# EAGLE design myBoardFPGA (EAGLE 9.6.2)
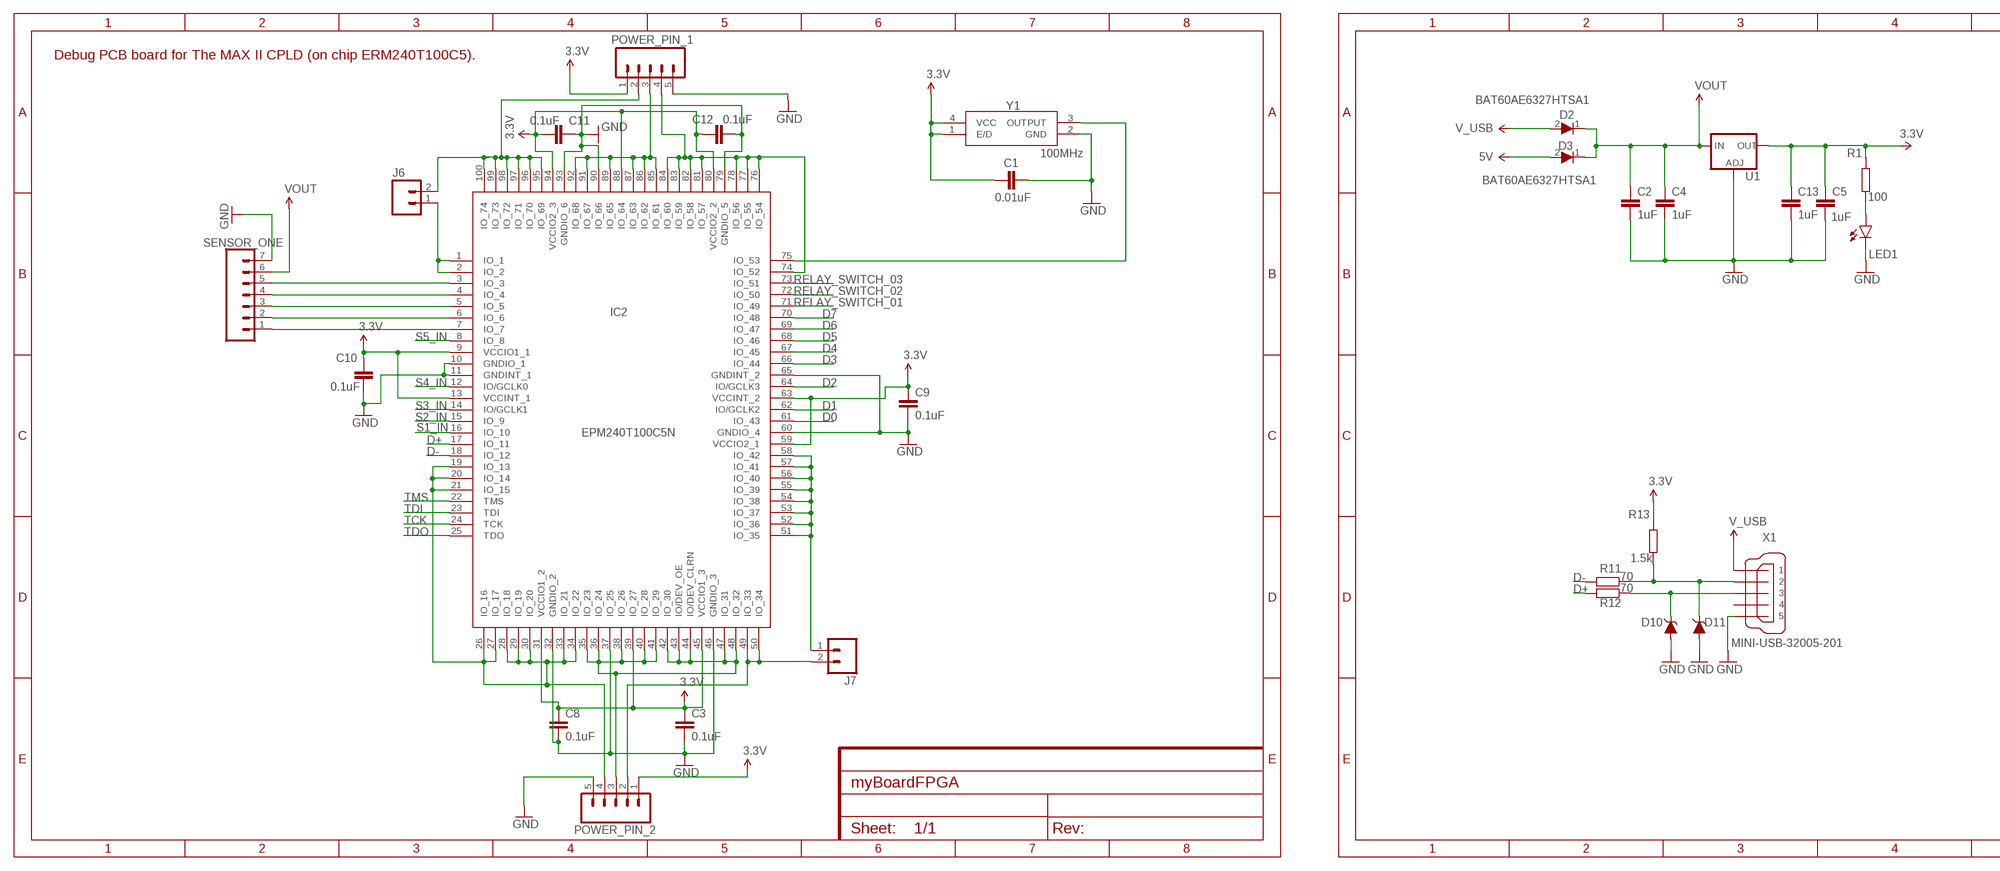
[diagram p0: schematic, sheet 1, part 1 of 2]
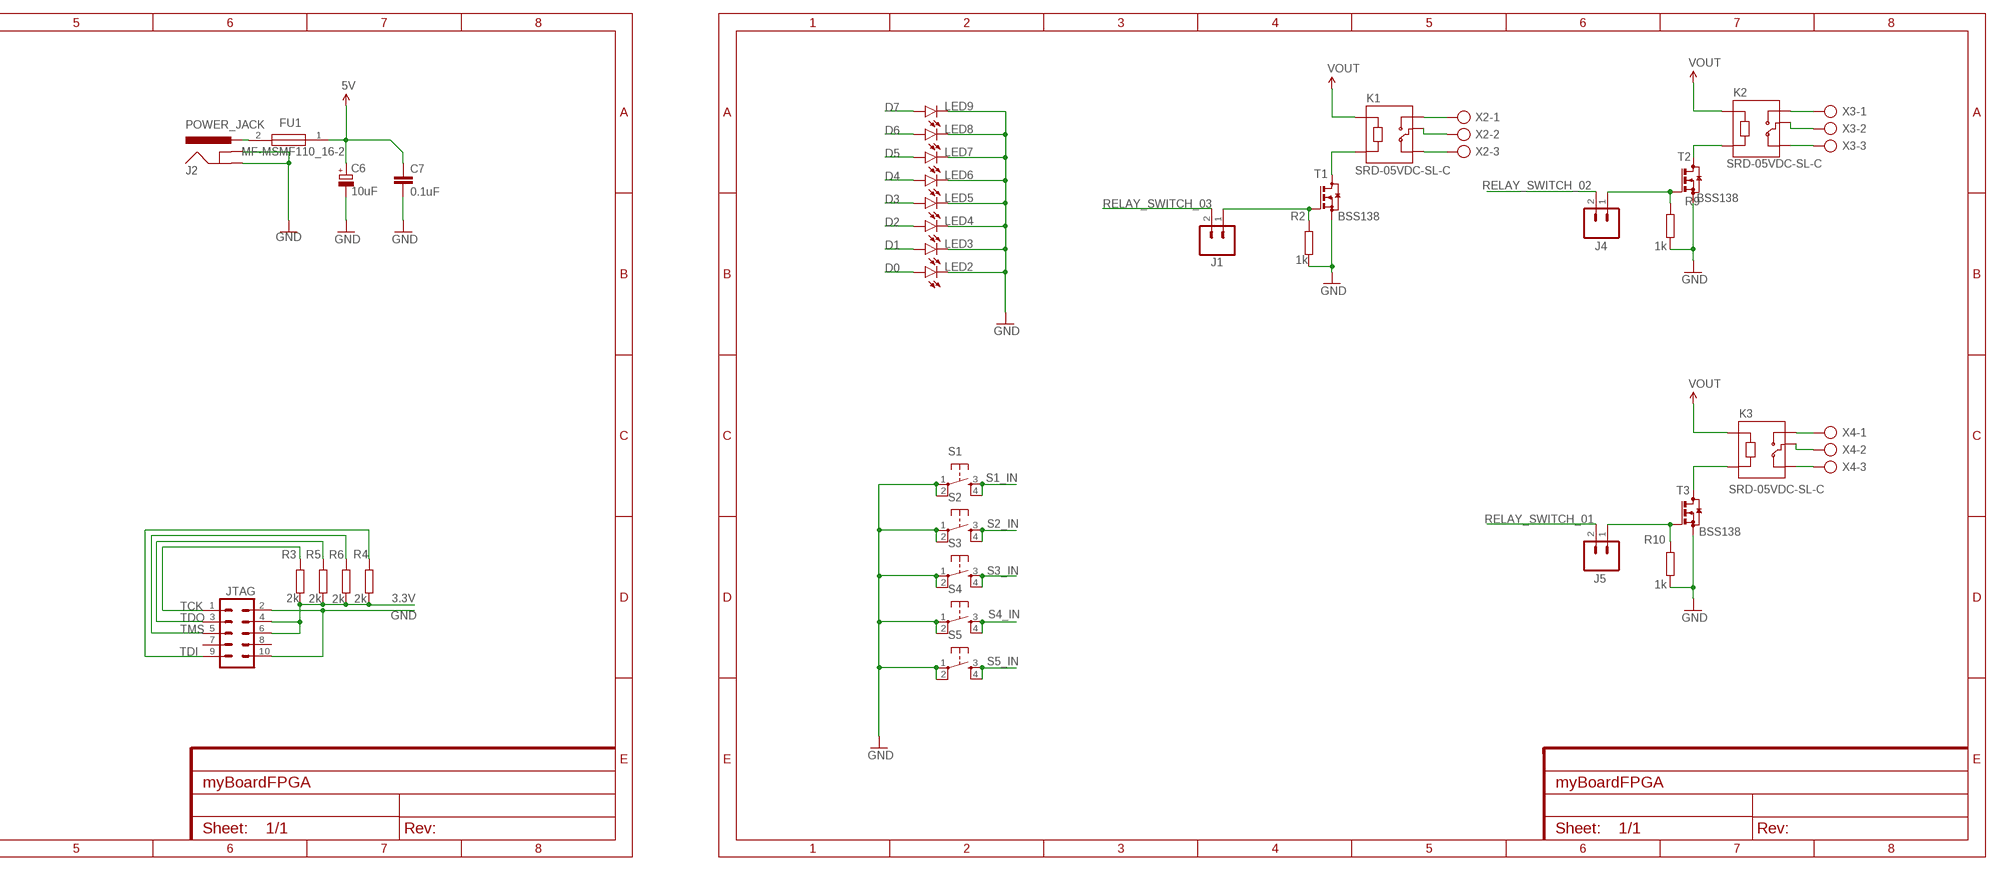
[diagram p1: schematic, sheet 1, part 2 of 2]

## Parts
C1  0.01uF  C-EUC1206  [C1206]
C2  1uF  C-EUC1206  [C1206]
C3  0.1uF  C-EUC1206  [C1206]
C4  1uF  C-EUC1206  [C1206]
C5  1uF  C-EUC1206  [C1206]
C6  10uF  CPOL-EUE2-5  [E2-5]
C7  0.1uF  C-EUC1206  [C1206]
C8  0.1uF  C-EUC1206  [C1206]
C9  0.1uF  C-EUC1206  [C1206]
C10  0.1uF  C-EUC1206  [C1206]
C11  0.1uF  C-EUC1206  [C1206]
C12  0.1uF  C-EUC1206  [C1206]
C13  1uF  C-EUC1206  [C1206]
D2  BAT60AE6327HTSA1  [SOD2513X110N]
D3  BAT60AE6327HTSA1  [SOD2513X110N]
D10  3.3V  DIODEZ  [BZV55C3V9TP]
D11  3.6  DIODEZ  [BZV55C3V9TP]
FU1  MF-MSMF110_16-2  [FUSC4632X85N]
IC2  EPM240T100C5N  [QFP50P1600X1600X120-100N]
J1  M02LOCK  [1X02_LOCK]
J2  POWER_JACK  [POWER_JACK_PTH]
J4  M02LOCK  [1X02_LOCK]
J5  M02LOCK  [1X02_LOCK]
J6  M02LOCK  [1X02_LOCK]
J7  M02LOCK  [1X02_LOCK]
JTAG  M05X2NO_SILK  [2X5_NOSILK]
K1  SRD-05VDC-SL-C  [RELAY_SRD-05VDC-SL-C]
K2  SRD-05VDC-SL-C  [RELAY_SRD-05VDC-SL-C]
K3  SRD-05VDC-SL-C  [RELAY_SRD-05VDC-SL-C]
LED1  LEDSML0805  [SML0805]
LED2  LEDSMT1206  [1206]
LED3  LEDSMT1206  [1206]
LED4  LEDSMT1206  [1206]
LED5  LEDSMT1206  [1206]
LED6  LEDSMT1206  [1206]
LED7  LEDSMT1206  [1206]
LED8  LEDSMT1206  [1206]
LED9  LEDSMT1206  [1206]
POWER_PIN_1  M05LOCK  [1X05_LOCK]
POWER_PIN_2  M05LOCK  [1X05_LOCK]
R1  100  R-EU_R1206  [R1206]
R2  1k  R-EU_R1206  [R1206]
R3  2k  R-EU_R1206  [R1206]
R4  2k  R-EU_R1206  [R1206]
R5  2k  R-EU_R1206  [R1206]
R6  2k  R-EU_R1206  [R1206]
R9  1k  R-EU_R1206  [R1206]
R10  1k  R-EU_R1206  [R1206]
R11  70  R-EU_R1206  [R1206]
R12  70  R-EU_R1206  [R1206]
R13  1.5k  R-EU_R1206  [R1206]
S1  TAC_SWITCHPTH  [TACTILE-PTH]
S2  TAC_SWITCHPTH  [TACTILE-PTH]
S3  TAC_SWITCHPTH  [TACTILE-PTH]
S4  TAC_SWITCHPTH  [TACTILE-PTH]
S5  TAC_SWITCHPTH  [TACTILE-PTH]
SENSOR_ONE  CONN_07  [1X07]
T1  BSS123  [SOT23]
T2  BSS123  [SOT23]
T3  BSS123  [SOT23]
U1  V_REG_LM1117SOT223  [SOT223]
X1  MINI-USB-32005-201  [32005-201]
X2  AK300/3  [AK300/3]
X3  AK300/3  [AK300/3]
X4  AK300/3  [AK300/3]
Y1  100MHz  CO4605-100.000-T-TR  [CO4605100000TTR]

## Nets
3.3V: C1.1 C3.1 C5.1 C8.1 C9.1 C10.1 C11.2 C12.1 C13.1 IC2.9(VCCIO1_1) IC2.13(VCCINT_1) IC2.31(VCCIO1_2) IC2.39(IO_27) IC2.45(VCCIO1_3) IC2.59(VCCIO2_1) IC2.63(VCCINT_2) IC2.80(VCCIO2_2) IC2.88(IO_64) IC2.94(VCCIO2_3) JTAG.4 JTAG.6 POWER_PIN_1.1 POWER_PIN_2.1 R1.2 R3.1 R4.1 R5.1 R6.1 R13.2 U1.2(OUT) U1.4(OUT) Y1.1(E/D) Y1.4(VCC)
5V: C6.+ C7.1 D3.2(A) FU1.1
D0: IC2.61(IO_43) LED2.A
D1: IC2.62(IO/GCLK2) LED3.A
D2: IC2.64(IO/GCLK3) LED4.A
D3: IC2.66(IO_44) LED5.A
D4: IC2.67(IO_45) LED6.A
D5: IC2.68(IO_46) LED7.A
D6: IC2.69(IO_47) LED8.A
D7: IC2.70(IO_48) LED9.A
D+: IC2.17(IO_11) R12.2
D-: IC2.18(IO_12) R11.2
GND: C1.2 C2.2 C3.2 C4.2 C5.2 C6.- C7.2 C8.2 C9.2 C10.2 C11.1 C12.2 C13.2 D10.1(A) D11.1(A) IC2.10(GNDIO_1) IC2.11(GNDINT_1) IC2.32(GNDIO_2) IC2.37(IO_25) IC2.46(GNDIO_3) IC2.60(GNDIO_4) IC2.65(GNDINT_2) IC2.79(GNDIO_5) IC2.90(IO_66) IC2.93(GNDIO_6) J2.GND J2.GNDBREAK JTAG.2 JTAG.10 LED1.C LED2.C LED3.C LED4.C LED5.C LED6.C LED7.C LED8.C LED9.C POWER_PIN_1.5 POWER_PIN_2.5 R2.1 R9.1 R10.1 S1.1 S1.2 S2.1 S2.2 S3.1 S3.2 S4.1 S4.2 S5.1 S5.2 SENSOR_ONE.7 T1.2(S) T2.2(S) T3.2(S) U1.1(ADJ) X1.5 Y1.2(GND)
N$1: K1.A2 T1.3(D)
N$2: LED1.A R1.1
N$3: K1.NO X2.1
N$4: K1.NC X2.3
N$5: K2.A2 T2.3(D)
N$6: J1.1 R2.2 T1.1(G)
N$7: K3.A2 T3.3(D)
N$8: J4.1 R9.2 T2.1(G)
N$9: J5.1 R10.2 T3.1(G)
N$10: K1.COM X2.2
N$11: K2.NO X3.1
N$12: K2.COM X3.2
N$13: K2.NC X3.3
N$14: K3.COM X4.2
N$15: K3.NO X4.1
N$16: K3.NC X4.3
N$18: IC2.35(IO_23) IC2.36(IO_24) IC2.38(IO_26) IC2.40(IO_28) IC2.41(IO_29) IC2.42(IO_30) IC2.43(IO/DEV_OE) IC2.44(IO/DEV_CLRN) IC2.47(IO_31) IC2.48(IO_32) POWER_PIN_2.3
N$20: IC2.19(IO_13) IC2.20(IO_14) IC2.21(IO_15) IC2.26(IO_16) IC2.27(IO_17) IC2.28(IO_18) IC2.29(IO_19) IC2.30(IO_20) IC2.33(IO_21) IC2.34(IO_22) POWER_PIN_2.4
N$21: D11.2(C) R11.1 R13.1 X1.2
N$22: D10.2(C) R12.1 X1.3
N$23: IC2.7(IO_7) SENSOR_ONE.1
N$24: IC2.49(IO_33) IC2.50(IO_34) J7.2 POWER_PIN_2.2
N$25: IC2.6(IO_6) SENSOR_ONE.2
N$26: IC2.5(IO_5) SENSOR_ONE.3
N$27: IC2.51(IO_35) IC2.52(IO_36) IC2.53(IO_37) IC2.54(IO_38) IC2.55(IO_39) IC2.56(IO_40) IC2.57(IO_41) IC2.58(IO_42) J7.1
N$28: IC2.75(IO_53) Y1.3(OUTPUT)
N$29: IC2.4(IO_4) SENSOR_ONE.4
N$30: IC2.3(IO_3) SENSOR_ONE.5
N$31: IC2.1(IO_1) IC2.2(IO_2) J6.1
N$32: IC2.95(IO_69) IC2.96(IO_70) IC2.97(IO_71) IC2.98(IO_72) IC2.99(IO_73) IC2.100(IO_74) J6.2 POWER_PIN_1.2
N$33: FU1.2 J2.PWR
N$35: IC2.74(IO_52) IC2.76(IO_54) IC2.77(IO_55) IC2.78(IO_56) IC2.81(IO_57) IC2.82(IO_58) IC2.83(IO_59) IC2.84(IO_60) POWER_PIN_1.4
N$36: IC2.85(IO_61) IC2.86(IO_62) IC2.87(IO_63) IC2.89(IO_65) IC2.91(IO_67) IC2.92(IO_68) POWER_PIN_1.3
RELAY_SWITCH_01: IC2.71(IO_49) J5.2
RELAY_SWITCH_02: IC2.72(IO_50) J4.2
RELAY_SWITCH_03: IC2.73(IO_51) J1.2
S1_IN: IC2.16(IO_10) S1.3 S1.4
S2_IN: IC2.15(IO_9) S2.3 S2.4
S3_IN: IC2.14(IO/GCLK1) S3.3 S3.4
S4_IN: IC2.12(IO/GCLK0) S4.3 S4.4
S5_IN: IC2.8(IO_8) S5.3 S5.4
TCK: IC2.24(TCK) JTAG.1 R3.2
TDI: IC2.23(TDI) JTAG.9 R4.2
TDO: IC2.25(TDO) JTAG.3 R5.2
TMS: IC2.22(TMS) JTAG.5 R6.2
V_USB: D2.2(A) X1.1
VOUT: C2.1 C4.1 D2.1(K) D3.1(K) K1.A1 K2.A1 K3.A1 SENSOR_ONE.6 U1.3(IN)
Unconnected: JTAG.7 JTAG.8 X1.4

## Notes on the sheet
- Debug PCB board for The MAX II CPLD (on chip ERM240T100C5).

## Library data of the parts
C1-C5 C7-C13 = rcl:C-EU: CAPACITOR, European symbol; SPICEPREFIX: C
C6 = rcl:CPOL-EU: POLARIZED CAPACITOR, European symbol; SPICEPREFIX: C
D2 D3 = SamacSys_Parts:BAT60AE6327HTSA1: INFINEON - BAT60AE6327HTSA1 - RECTIFIER, SCHOTTKY, 3A, 10V, SOD-323 Source: Datasheet <https://www.infineon.com/dgdl/Infineon-BAT60ASERIES-DS-v01_01-en.pdf?fileId=db3a304313d846880113def70c9304a9>; ARROW_PART_NUMBER: BAT60AE6327HTSA1; ARROW_PRICE-STOCK: https://www.arrow.com/en/products/bat60ae6327htsa1/infineon-technologies-ag; DESCRIPTION: INFINEON - BAT60AE6327HTSA1 - RECTIFIER, SCHOTTKY, 3A, 10V, SOD-323; HEIGHT: 1.1mm; MANUFACTURER_NAME: Infineon; MANUFACTURER_PART_NUMBER: BAT60AE6327HTSA1; MOUSER_PART_NUMBER: 726-BAT60AE6327HTSA1; MOUSER_PRICE-STOCK: https://www.mouser.co.uk/ProductDetail/Infineon-Technologies/BAT60AE6327HTSA1?qs=OwbwYO03UsIW3Y2lCXbs8Q%3D%3D
D10 = myZd:DIODEZ
D11 = myZd:DIODEZ; SDA: 3.6V
FU1 = SamacSys_Parts:MF-MSMF110_16-2: Fuse, PTC, Resettable, SMD,1812,1.1A,16V Bourns 1.1A Surface Mount Resettable Fuse, 16 V Source: Datasheet <https://componentsearchengine.com/Datasheets/2/MF-MSMF110_16-2.pdf>; ARROW_PART_NUMBER: MF-MSMF110/16-2; ARROW_PRICE-STOCK: https://www.arrow.com/en/products/mf-msmf11016-2/bourns; DESCRIPTION: Fuse, PTC, Resettable, SMD,1812,1.1A,16V Bourns 1.1A Surface Mount Resettable Fuse, 16 V; HEIGHT: 0.85mm; MANUFACTURER_NAME: Bourns; MANUFACTURER_PART_NUMBER: MF-MSMF110/16-2; MOUSER_PART_NUMBER: 652-MF-MSMF110/16-2; MOUSER_PRICE-STOCK: https://www.mouser.co.uk/ProductDetail/Bourns/MF-MSMF110-16-2?qs=wksszfECgvir54ST3ixUHA%3D%3D
IC2 = SamacSys_Parts:EPM240T100C5N: CPLD Max II EPM240T100C5N, TQFP100 EPM240T100C5N, CPLD MAX II Flash 192 Cells, 80 I/O, 24 Labs, ISP, 2.375 3.6 V 100-Pin TQFP Source: Datasheet <http://docs-emea.rs-online.com/webdocs/13d1/0900766b813d195a.pdf>; ARROW_PART_NUMBER: EPM240T100C5N; ARROW_PRICE-STOCK: https://www.arrow.com/en/products/epm240t100c5n/intel; DESCRIPTION: CPLD Max II EPM240T100C5N, TQFP100 EPM240T100C5N, CPLD MAX II Flash 192 Cells, 80 I/O, 24 Labs, ISP, 2.375 3.6 V 100-Pin TQFP; HEIGHT: 1.2mm; MANUFACTURER_NAME: Intel; MANUFACTURER_PART_NUMBER: EPM240T100C5N; MOUSER_PART_NUMBER: 989-EPM240T100C5N; MOUSER_PRICE-STOCK: https://www.mouser.co.uk/ProductDetail/Intel-Altera/EPM240T100C5N?qs=jblrfmjbeiHmgaW5DQXOiw%3D%3D
J1 J4-J7 = SparkFun-Connectors:M02: Standard 2-pin 0.1" header. Use with - straight break away headers ( PRT-00116) - right angle break away headers (PRT-00553) - swiss pins (PRT-00743) - machine pins (PRT-00117) - female headers (PRT-00115) Molex polarized connector foot print use with: PRT-08233 with associated crimp pins and housings. 2.54_SCREWTERM for use with PRT-10571. 3.5mm Screw Terminal footprints for PRT-08084 5mm Screw Terminal footprints for use with PRT-08432
J2 = SparkFun-Connectors:POWER_JACK: Power Jack Connector This is the standard 5.5mm barrel jack for power. The PTH is the most common, proven, reliable, footprint. The Slot footprint only works if the mill layer is transmitted to the PCB fab house so be warned. Here are the connectors we sell at SparkFun: DC Barrel Power Jack/Connector <https://www.sparkfun.com/products/119> (PRT-00119) DC Barrel Power Jack/Connector (SMD) <https://www.sparkfun.com/products/12748> (PRT-12748) DC Barrel Jack Adapter - Breadboard Compatible <https://www.sparkfun.com/products/10811> (PRT-10811) It is used on this SparkFun product (and many, many others): SparkFun RedBoard - Programmed with Arduino <https://www.sparkfun.com/products/12757> (DEV-12757) Also, if you need a mating power supply or connector, please check these out: Wall Adapter Power Supply - 9VDC 650mA <https://www.sparkfun.com/products/298> (TOL-00298) DC Barrel Jack Adapter - Male <https://www.sparkfun.com/products/10287> (PRT-10287); PROD_ID: CONN-08197
JTAG = SparkFun-Connectors:M05X2: Header 5x2 Standard 10-pin dual row 0.1" header. Commonly used with AVR-ISP. Use with Spark Fun Electronics SKU: PRT-00778
K1-K3 = SRD-05VDC-SL-C:SRD-05VDC-SL-C: 5V Trigger Relay Module For Arduino And Raspberry Pi 5V Trigger Relay Module For Arduino And Raspberry Pi; AVAILABILITY: Unavailable; DESCRIPTION: 5V Trigger Relay Module For Arduino And Raspberry Pi 5V Trigger Relay Module For Arduino And Raspberry Pi; MF: Songle Relay; MP: SRD-05VDC-SL-C; PACKAGE: None; PRICE: None
LED1-LED9 = led:LED: LED OSRAM: - CHIPLED LG R971, LG N971, LY N971, LG Q971, LY Q971, LO R971, LY R971 LH N974, LH R974 LS Q976, LO Q976, LY Q976 LO Q996 - Hyper CHIPLED LW Q18S LB Q993, LB Q99A, LB R99A - SideLED LS A670, LO A670, LY A670, LG A670, LP A670 LB A673, LV A673, LT A673, LW A673 LH A674 LY A675 LS A676, LA A676, LO A676, LY A676, LW A676 LS A679, LY A679, LG A679 - Hyper Micro SIDELED® LS Y876, LA Y876, LO Y876, LY Y876 LT Y87S - SmartLED LW L88C, LW L88S LB L89C, LB L89S, LG L890 LS L89K, LO L89K, LY L89K LS L896, LA L896, LO L896, LY L896 - TOPLED LS T670, LO T670, LY T670, LG T670, LP T670 LSG T670, LSP T670, LSY T670, LOP T670, LYG T670 LG T671, LOG T671, LSG T671 LB T673, LV T673, LT T673, LW T673 LH T674 LS T676, LA T676, LO T676, LY T676, LB T676, LH T676, LSB T676, LW T676 LB T67C, LV T67C, LT T67C, LS T67K, LO T67K, LY T67K, LW E67C LS E67B, LA E67B, LO E67B, LY E67B, LB E67C, LV E67C, LT E67C LW T67C LS T679, LY T679, LG T679 LS T770, LO T770, LY T770, LG T770, LP T770 LB T773, LV T773, LT T773, LW T773 LH T774 LS E675, LA E675, LY E675, LS T675 LS T776, LA T776, LO T776, LY T776, LB T776 LHGB T686 LT T68C, LB T68C - Hyper Mini TOPLED® LB M676 - Mini TOPLED Santana® LG M470 LS M47K, LO M47K, LY M47K Source: http://www.osram.convergy.de LUXEON: - LUMILED® LXK2-PW12-R00, LXK2-PW12-S00, LXK2-PW14-U00, LXK2-PW14-V00 LXK2-PM12-R00, LXK2-PM12-S00, LXK2-PM14-U00 LXK2-PE12-Q00, LXK2-PE12-R00, LXK2-PE12-S00, LXK2-PE14-T00, LXK2-PE14-U00 LXK2-PB12-K00, LXK2-PB12-L00, LXK2-PB12-M00, LXK2-PB14-N00, LXK2-PB14-P00, LXK2-PB14-Q00 LXK2-PR12-L00, LXK2-PR12-M00, LXK2-PR14-Q00, LXK2-PR14-R00 LXK2-PD12-Q00, LXK2-PD12-R00, LXK2-PD12-S00 LXK2-PH12-R00, LXK2-PH12-S00 LXK2-PL12-P00, LXK2-PL12-Q00, LXK2-PL12-R00 Source: www.luxeon.com KINGBRIGHT: KA-3528ASYC Source: www.kingbright.com
POWER_PIN_1 POWER_PIN_2 = SparkFun-Connectors:M05: Header 5 Standard 5-pin 0.1" header. Use with straight break away headers (SKU : PRT-00116), right angle break away headers (PRT-00553), swiss pins (PRT-00743), machine pins (PRT-00117), and female headers (PRT-00115). Molex polarized connector foot print use with SKU : PRT-08230 with associated crimp pins and housings.
R1-R6 R9-R13 = rcl:R-EU_: RESISTOR, European symbol; SPICEPREFIX: R
S1-S5 = SparkFun-Retired:TAC_SWITCH: Momentary Switch Button commonly used for reset or general input. Spark Fun Electronics SKU : COM-00097 SMT- SWCH-08247
SENSOR_ONE = SparkFun-Connectors:CONN_07: Multi connection point. Often used as Generic Header-pin footprint for 0.1 inch spaced/style header connections On any of the 0.1 inch spaced packages, you can populate with these: Break Away Headers - Straight <https://www.sparkfun.com/products/116> (PRT-00116) Break Away Male Headers - Right Angle <https://www.sparkfun.com/products/553> (PRT-00553) Female Headers <https://www.sparkfun.com/products/115> (PRT-00115) Break Away Headers - Machine Pin <https://www.sparkfun.com/products/117> (PRT-00117) Break Away Female Headers - Swiss Machine Pin <https://www.sparkfun.com/products/743> (PRT-00743) For SCREWTERMINALS and SPRING TERMINALS visit here: Screw Terimnals on SparkFun.com <https://www.sparkfun.com/search/results?term=Screw+Terminals> (5mm/3.5mm/2.54mm spacing) This device is also useful as a general connection point to wire up your design to another part of your project. Our various solder wires solder well into these plated through hole pads. Hook-Up Wire - Assortment (Stranded, 22 AWG) <https://www.sparkfun.com/products/11375> (PRT-11375) Hook-Up Wire - Assortment (Solid Core, 22 AWG) <https://www.sparkfun.com/products/11367> (PRT-11367) View the entire wire category on our website here <https://www.sparkfun.com/categories/141> Special notes: Molex polarized connector foot print use with SKU : PRT-08231 with associated crimp pins and housings. 1MM SMD Version SKU: PRT-10208 NOTES ON THE VARIANTS LOCK and LOCK_LONGPADS... This footprint was designed to help hold the alignment of a through-hole component (i.e. 6-pin header) while soldering it into place. You may notice that each hole has been shifted either up or down by 0.005 of an inch from it's more standard position (which is a perfectly straight line). This slight alteration caused the pins (the squares in the middle) to touch the edges of the holes. Because they are alternating, it causes a "brace" to hold the component in place. 0.005 has proven to be the perfect amount of "off-center" position when using our standard breakaway headers. Although looks a little odd when you look at the bare footprint, once you have a header in there, the alteration is very hard to notice. Also,if you push a header all the way into place, it is covered up entirely on the bottom side.
T1 T3 = transistor-small-signal:BSS123: N-CHANNEL MOS FET; NEW: BSS138
T2 = transistor-small-signal:BSS123: N-CHANNEL MOS FET; BSS138: BSS138
U1 = SparkFun-IC-Power:V_REG_LM1117: Voltage Regulator LM1117 Standard adjustable voltage regulator but in SMD form. Spark Fun Electronics SKU : COM-00595; PROD_ID: VREG-08170
X1 = con-cypressindustries:MINI-USB-: MINI USB-B Conector Source: www.cypressindustries.com; OC_FARNELL: unknown; OC_NEWARK: unknown
X2-X4 = con-ptr500:AK300/3: CONNECTOR; OC_FARNELL: unknown; OC_NEWARK: unknown
Y1 = SamacSys_Parts:CO4605-100.000-T-TR: Surface Mount Clock Oscilators. Source: Datasheet <http://www.raltron.com//wp-content/uploads/2018/12/clock_co43_46_Series-updated.pdf>; DESCRIPTION: Surface Mount Clock Oscilators.; HEIGHT: 1.8mm; MANUFACTURER_NAME: Raltron Electronics; MANUFACTURER_PART_NUMBER: CO4605-100.000-T-TR; NEW: 100MHz

## Board
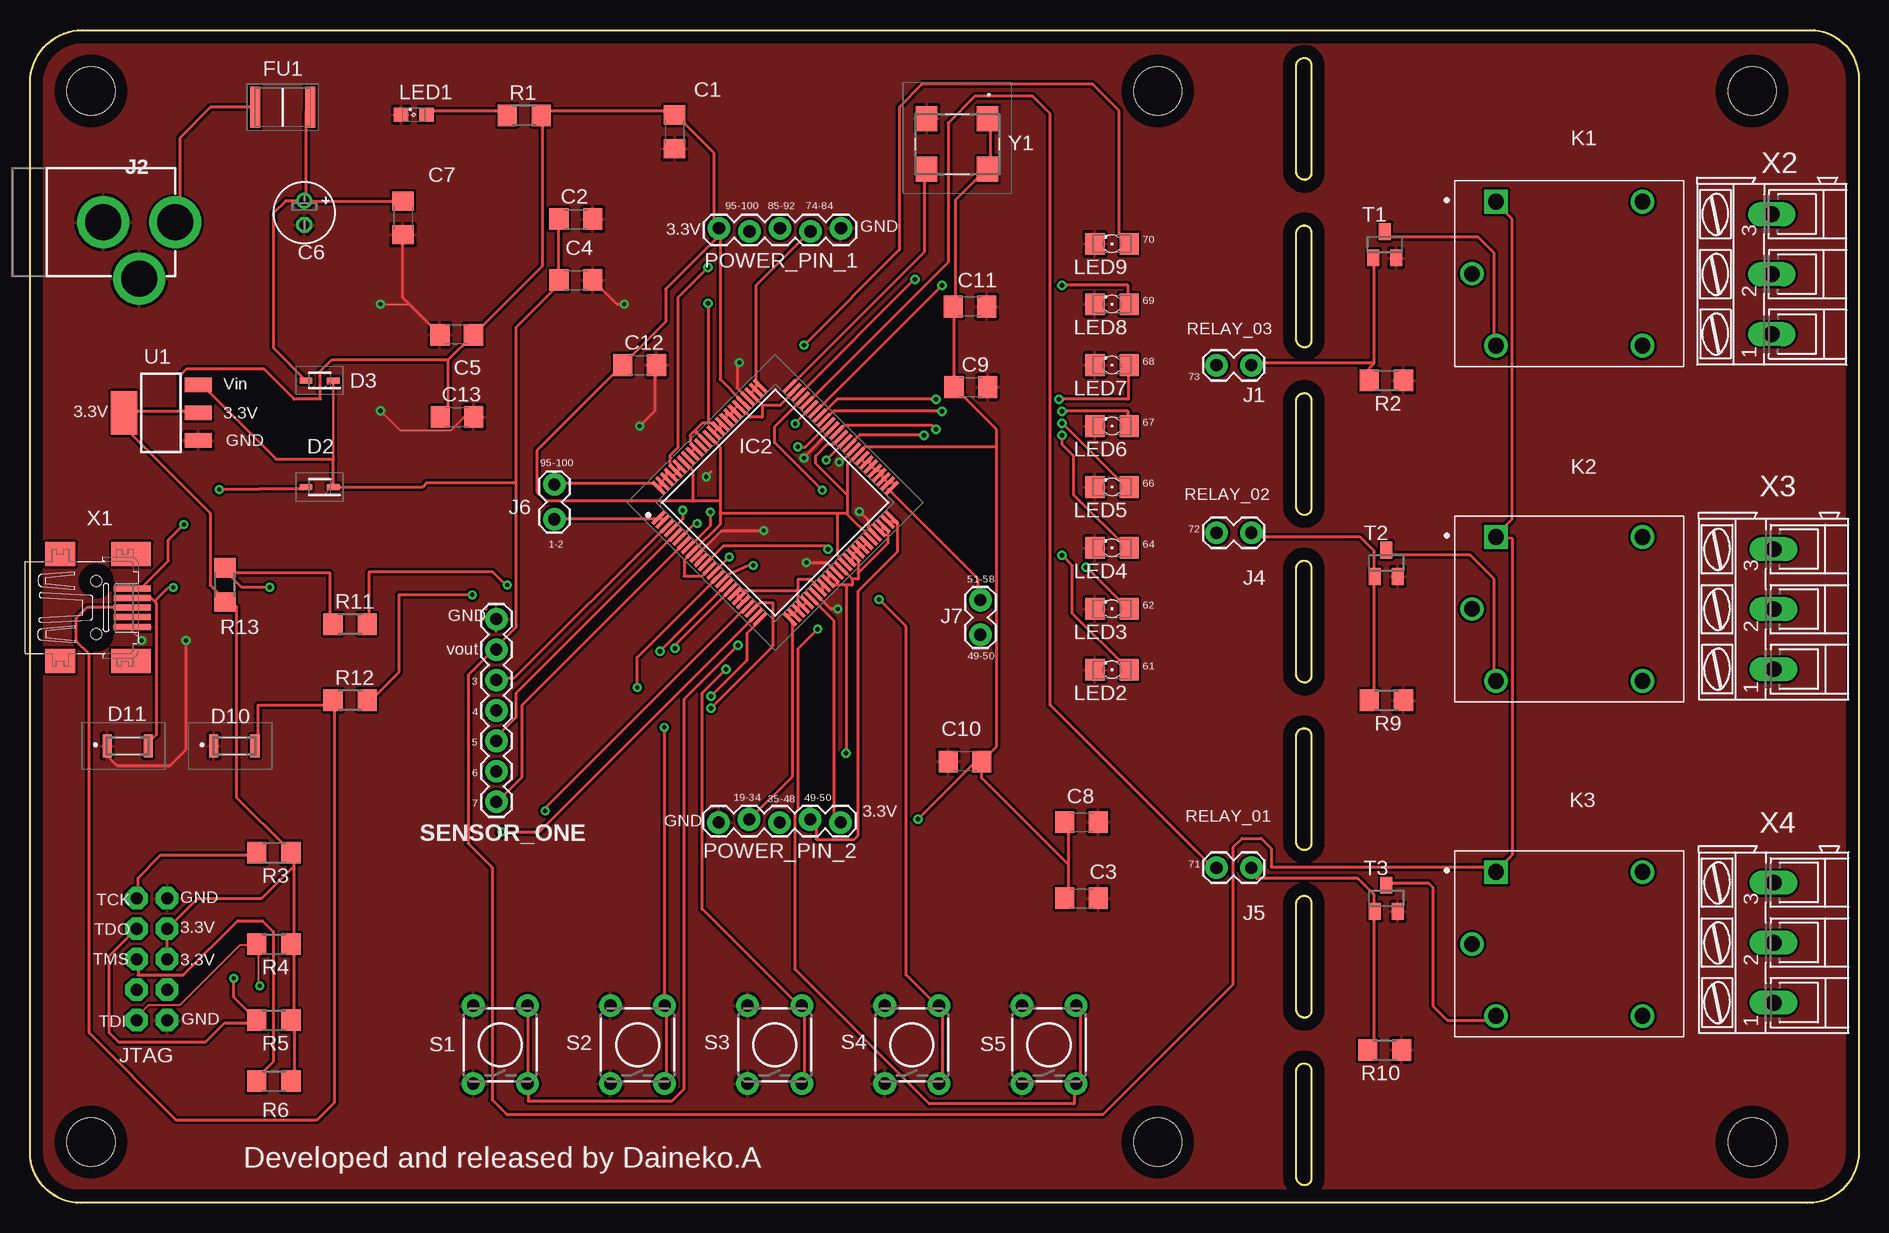
[diagram p2: board, top side]
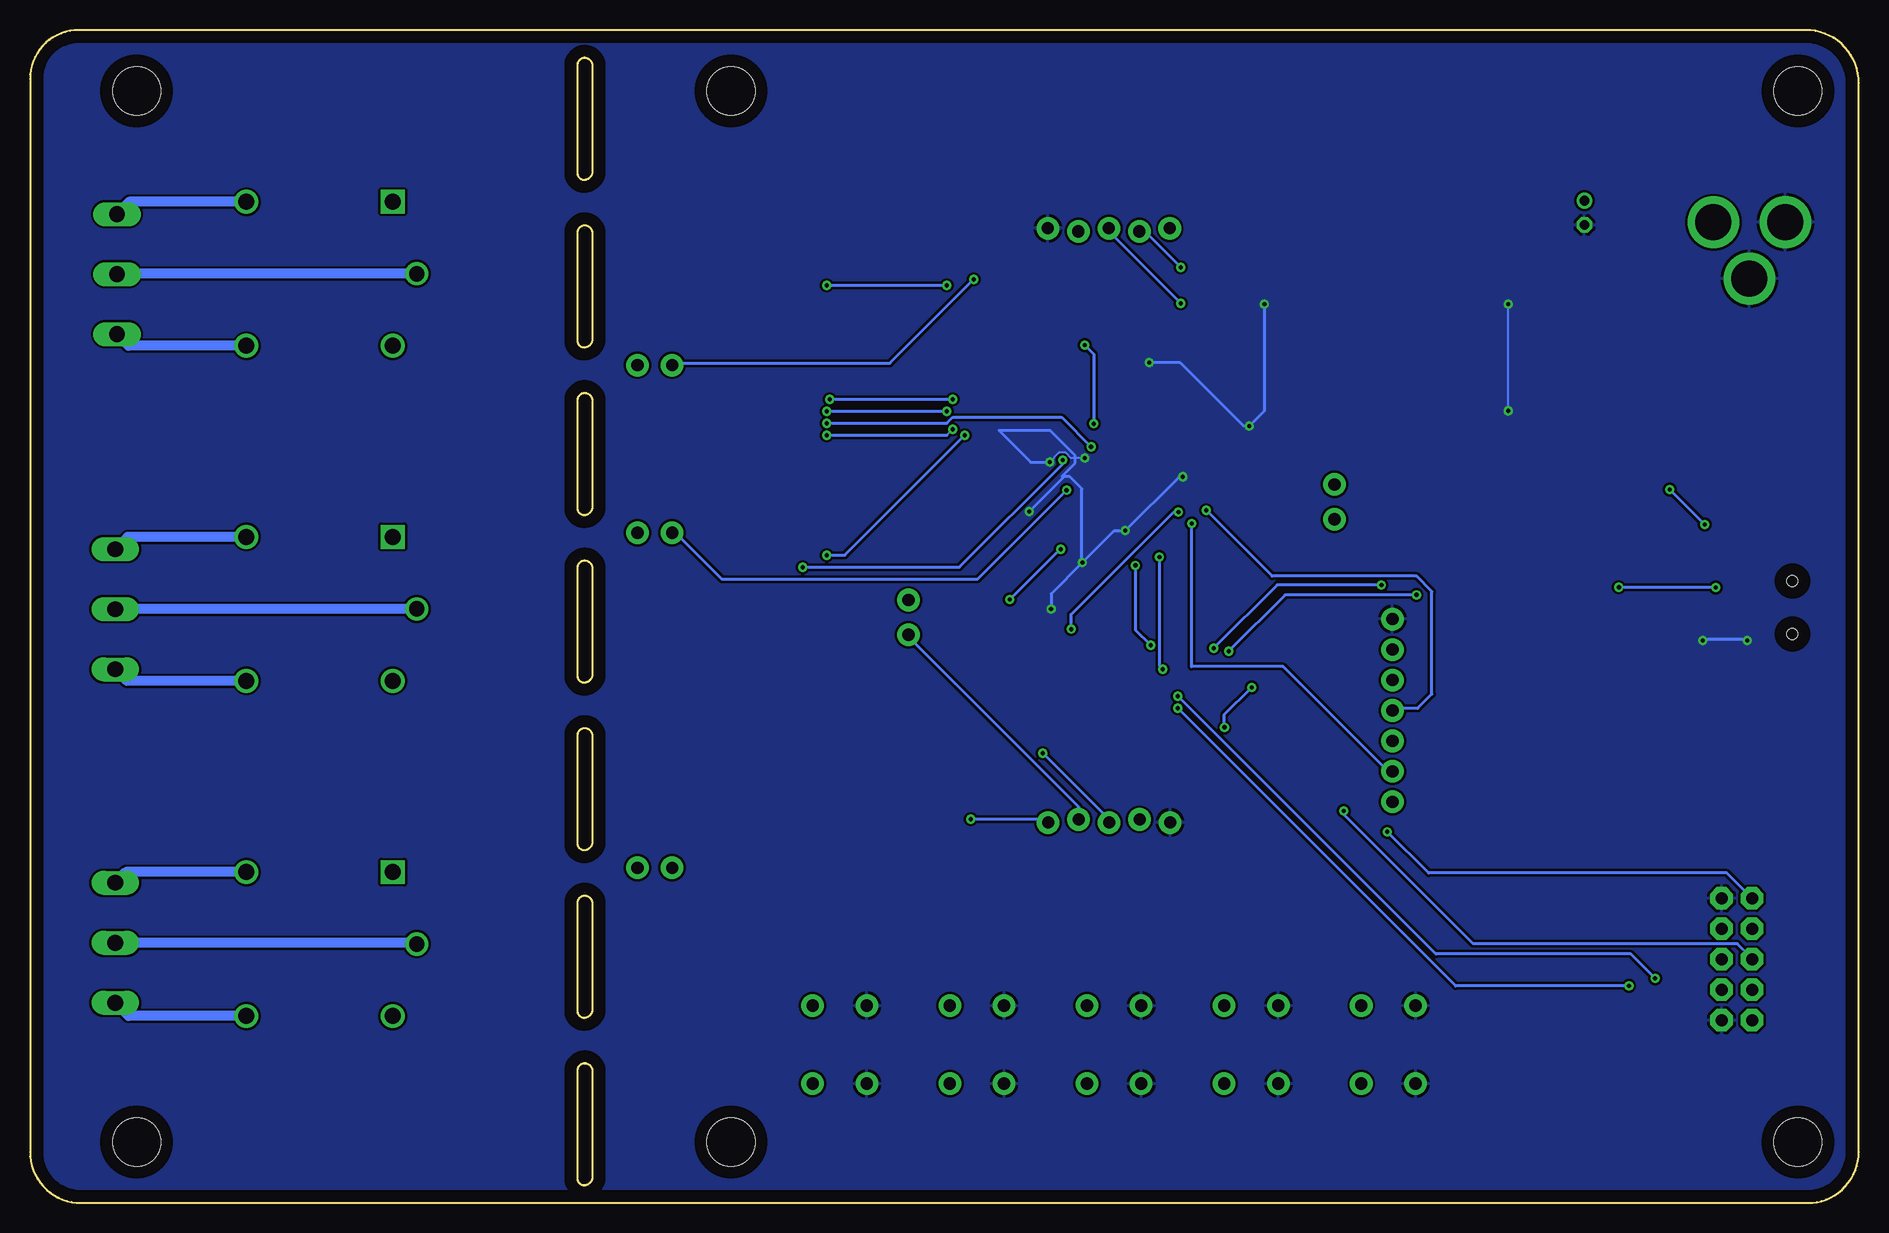
[diagram p3: board, bottom side, seen from below]

Size 152.4 x 97.79 mm. Coordinates in mm from the lower left corner, seen from the top.
Outline: 106.23,1.48 arc-90 105.51,2.2 105.51,10.96 arc-90 106.19,11.64 arc-90 106.78,11.05 106.78,2.03 arc-90 106.23,1.48
Outline: 106.23,15.45 arc-90 105.51,16.17 105.51,24.93 arc-90 106.19,25.61 arc-90 106.78,25.02 106.78,16 arc-90 106.23,15.45
Outline: 106.23,29.42 arc-90 105.51,30.14 105.51,38.9 arc-90 106.19,39.58 arc-90 106.78,38.99 106.78,29.97 arc-90 106.23,29.42
Outline: 106.23,43.39 arc-90 105.51,44.11 105.51,52.87 arc-90 106.19,53.55 arc-90 106.78,52.96 106.78,43.94 arc-90 106.23,43.39
Outline: 106.23,57.36 arc-90 105.51,58.08 105.51,66.84 arc-90 106.19,67.52 arc-90 106.78,66.93 106.78,57.91 arc-90 106.23,57.36
Outline: 106.23,71.33 arc-90 105.51,72.05 105.51,80.81 arc-90 106.19,81.49 arc-90 106.78,80.9 106.78,71.88 arc-90 106.23,71.33
Outline: 106.23,85.3 arc-90 105.51,86.02 105.51,94.78 arc-90 106.19,95.46 arc-90 106.78,94.87 106.78,85.85 arc-90 106.23,85.3
Outline: 152.4,93.71 152.4,4.25 arc-90 148.15,0 4.27,0 arc-90 0,4.27 0,93.38 arc-90 4.42,97.79 148.32,97.79 arc-90 152.4,93.71
Copper layers (1*16): Top 0.035mm / dielectric 1.5mm / Bottom 0.035mm
Design rules "default *": minimum track width 6mil, minimum drill 0.35mm, track to track 8mil, track to pad 6mil, pad to pad 6mil, via to via 6mil, smd to smd 6mil, copper to edge 40mil, drill to drill 6mil, minimum pad ring 10mil, minimum via ring 8mil, stop-mask expansion 4mil, vias tented up to drill 0mil, thermal gap 10mil
Holes 4 mm at 5.08,5.08 143.51,5.08 5.08,92.71 143.51,92.71 93.98,5.08 93.98,92.71

### Footprints (pad centres in the part's own frame; a part is rotated, then mirrored left to right if it is on the bottom)
C1206 = smd 1.6 x 1.8: 1 -1.4,0; 2 1.4,0
E2-5 = drill 0.813 pad 1.27: + -1.016,0 | drill 0.813 pad 1.27 octagon: - 1.016,0
SOD2513X110N = smd 1.05 x 0.5: 1 -1.138,0; 2 1.138,0
BZV55C3V9TP = smd 0.762 x 1.905: 1 -1.191,0; 2 2.238,0
FUSC4632X85N = smd 0.85 x 3.43: 1 -2.3,0; 2 2.3,0
QFP50P1600X1600X120-100N = smd 1.475 x 0.3: 1 -7.738,6; 2 -7.738,5.5; 3 -7.738,5; 4 -7.738,4.5; 5 -7.738,4; 6 -7.738,3.5; 7 -7.738,3; 8 -7.738,2.5; 9 -7.738,2; 10 -7.738,1.5; 11 -7.738,1; 12 -7.738,0.5; 13 -7.738,0; 14 -7.738,-0.5; 15 -7.738,-1; 16 -7.738,-1.5; 17 -7.738,-2; 18 -7.738,-2.5; 19 -7.738,-3; 20 -7.738,-3.5; 21 -7.738,-4; 22 -7.738,-4.5; 23 -7.738,-5; 24 -7.738,-5.5; 25 -7.738,-6; 51 7.738,-6; 52 7.738,-5.5; 53 7.738,-5; 54 7.738,-4.5; 55 7.738,-4; 56 7.738,-3.5; 57 7.738,-3; 58 7.738,-2.5; 59 7.738,-2; 60 7.738,-1.5; 61 7.738,-1; 62 7.738,-0.5; 63 7.738,0; 64 7.738,0.5; 65 7.738,1; 66 7.738,1.5; 67 7.738,2; 68 7.738,2.5; 69 7.738,3; 70 7.738,3.5; 71 7.738,4; 72 7.738,4.5; 73 7.738,5; 74 7.738,5.5; 75 7.738,6 | smd 0.3 x 1.475: 26 -6,-7.738; 27 -5.5,-7.738; 28 -5,-7.738; 29 -4.5,-7.738; 30 -4,-7.738; 31 -3.5,-7.738; 32 -3,-7.738; 33 -2.5,-7.738; 34 -2,-7.738; 35 -1.5,-7.738; 36 -1,-7.738; 37 -0.5,-7.738; 38 0,-7.738; 39 0.5,-7.738; 40 1,-7.738; 41 1.5,-7.738; 42 2,-7.738; 43 2.5,-7.738; 44 3,-7.738; 45 3.5,-7.738; 46 4,-7.738; 47 4.5,-7.738; 48 5,-7.738; 49 5.5,-7.738; 50 6,-7.738; 76 6,7.738; 77 5.5,7.738; 78 5,7.738; 79 4.5,7.738; 80 4,7.738; 81 3.5,7.738; 82 3,7.738; 83 2.5,7.738; 84 2,7.738; 85 1.5,7.738; 86 1,7.738; 87 0.5,7.738; 88 0,7.738; 89 -0.5,7.738; 90 -1,7.738; 91 -1.5,7.738; 92 -2,7.738; 93 -2.5,7.738; 94 -3,7.738; 95 -3.5,7.738; 96 -4,7.738; 97 -4.5,7.738; 98 -5,7.738; 99 -5.5,7.738; 100 -6,7.738
1X02_LOCK = drill 1.016 pad 1.88: 1 -0.178,0; 2 2.718,0
POWER_JACK_PTH = drill 2.997 pad 4.318: GND 0,7.7; GNDBREAK 4.7,10.7; PWR 0,13.7
2X5_NOSILK = drill 1.016 pad 1.88 octagon: 1 -1.27,5.08; 2 1.27,5.08; 3 -1.27,2.54; 4 1.27,2.54; 5 -1.27,0; 6 1.27,0; 7 -1.27,-2.54; 8 1.27,-2.54; 9 -1.27,-5.08; 10 1.27,-5.08
RELAY_SRD-05VDC-SL-C = drill 1.32 square: A1 -6.1,6 | drill 1.32: A2 -6.1,-6; NC 6.1,6; NO 6.1,-6 | drill 1.29: COM -8.1,0
SML0805 = smd 1.2 x 1.2: A 1.05,0; C -1.05,0
1206 = smd 1.6 x 1.803: A -1.422,0; C 1.422,0
1X05_LOCK = drill 1.016 pad 1.88: 1 0,0.127; 2 2.54,-0.127; 3 5.08,0.127; 4 7.62,-0.127; 5 10.16,0.127
R1206 = smd 1.6 x 1.803: 1 -1.422,0; 2 1.422,0
TACTILE-PTH = drill 1.016 pad 1.88: 1 -3.251,2.261; 2 3.251,2.261; 3 -3.251,-2.261; 4 3.251,-2.261
1X07 = drill 1.016 pad 1.88: 1 0,0; 2 2.54,0; 3 5.08,0; 4 7.62,0; 5 10.16,0; 6 12.7,0; 7 15.24,0
SOT23 = smd 1 x 1.4: 1 -0.95,-1.1; 2 0.95,-1.1; 3 0,1.1
SOT223 = smd 1.219 x 2.235: 1 -2.311,-3.099; 2 0,-3.099; 3 2.311,-3.099 | smd 3.6 x 2.2: 4 0,3.099
32005-201 = smd 3.1 x 0.5: 1 3,1.6; 2 3,0.8; 3 3,0; 4 3,-0.8; 5 3,-1.6 | smd 2.5 x 2: M1 -3,-4.45; M2 -3,4.45 | smd 3.3 x 2: M3 2.9,4.45; M4 2.9,-4.45 | hole 0.9: 0,2.2; 0,-2.2
AK300/3 = drill 1.321 long: 1 -5.004,0; 2 0,0; 3 5.004,0
CO4605100000TTR = smd 1.8 x 2.1: 1 -2.54,-2.1; 2 2.54,-2.1; 3 2.54,2.1; 4 -2.54,2.1

### Placement (x,y rotation side)
C1  53.71,89.3 270 top
C2  45.49,82.03 0 top
C3  87.63,25.4 0 top
C4  45.49,76.95 0 top
C5  35.56,72.39 180 top
C6  22.86,82.55 270 top
C7  31.08,82.13 270 top
C8  87.63,31.75 0 top
C9  78.4,68.02 0 top
C10  77.91,36.8 180 top
C11  78.33,74.73 180 top
C12  50.8,69.85 0 top
C13  35.58,65.53 0 top
D2  24.13,59.69 180 top
D3  24.13,68.58 180 top
D10  16.51,38.1 0 top
D11  7.62,38.1 0 top
FU1  21.06,91.35 180 top
IC2  62.1,58.39 45 top
J1  101.6,69.85 180 top
J2  -1.59,81.76 270 top
J4  101.6,55.88 180 top
J5  101.6,27.94 180 top
J6  43.69,57.18 90 top
J7  79.19,50.09 270 top
JTAG  10.16,20.32 0 top
K1  128.27,77.47 0 top
K2  128.27,49.53 0 top
K3  128.27,21.59 0 top
LED1  31.98,90.73 0 top
LED2  90.17,44.45 180 top
LED3  90.17,49.53 180 top
LED4  90.17,54.61 180 top
LED5  90.17,59.69 180 top
LED6  90.17,64.77 180 top
LED7  90.17,69.85 180 top
LED8  90.17,74.93 180 top
LED9  90.17,79.96 180 top
POWER_PIN_1  57.42,81.13 0 top
POWER_PIN_2  67.55,31.85 180 top
R1  41.19,90.68 0 top
R2  113.03,68.58 180 top
R3  20.32,29.21 180 top
R4  20.32,21.59 180 top
R5  20.32,15.24 180 top
R6  20.32,10.16 180 top
R9  113.03,41.91 180 top
R10  112.9,12.76 180 top
R11  26.67,48.26 0 top
R12  26.67,41.91 0 top
R13  16.24,51.53 270 top
S1  39.2,13.2 90 top
S2  50.63,13.2 90 top
S3  62.06,13.2 90 top
S4  73.49,13.2 90 top
S5  84.92,13.2 90 top
SENSOR_ONE  38.86,33.44 90 top
T1  112.9,79.89 0 top
T2  113.03,53.34 0 top
T3  113.03,25.4 0 top
U1  10.93,65.88 90 top
X1  5.53,49.64 0 top
X2  145.15,77.43 90 top
X3  145.3,49.5 90 top
X4  145.3,21.7 90 top
Y1  77.26,88.29 180 top

### Tracks (layer width: path | path; a pad name or v marks a point on that pad's centre or on a via)
3.3V  (via drill 0.35)
  Top 0.152: 8,64.5 8,65.5 U1.4 8,66 | 16,50.5 R13.2 | 14,66 U1.2 | 22,10.5 R6.1 | 22,15 R5.1 22,15.5 | 22,21.5 R4.1 22,22 | 22,29 R3.1 21.5,29.5 | 57.5,81 57.5,80.74 | 49.5,70 C12.1 49,69.5 | R1.2 42.69,90.6 | 68,57.5 68.12,57.38 | 70,55.5 IC2.45 | 55.33,54.4 IC2.9 | 57,63.5 IC2.88 | 86.5,31.5 C8.1 | 80,86.5 Y1.4 79.5,86 | 80,90 Y1.1 | 77,74.5 C11.2 77.13,75.5 | 77,68 C9.1 | 69,62.5 IC2.59 | 79,37 C10.1 | 67.75,53.5 IC2.39 | 54.75,61.5 IC2.94 | 67.5,63.75 IC2.63
  Top 0.254: 16,50.5 15,51.5 15,57.5 8,64.5 | 8,66 12.5,66 | 12.5,66 14,66 | 22,15 22,10.5 | 22,15.5 22,21.5 | 22,22 22,28.1 | 22,28.1 22,29 | 21.5,29.5 17.21,33.79 17.21,49.7 R13.2 | IC2.80 59.46,66.71 57.5,68.67 57.5,80.74 52.96,76.2 52.96,73.46 49.5,70 | 57.5,81 POWER_PIN_1.1 57,81.5 57,87.5 54,90.5 C1.1 53.5,91 43,91 R1.2 | 42.69,90.6 42.69,80.01 42.69,79.69 42.69,78.12 C5.1 34.87,70.3 | IC2.31 65.5,50 67,48.5 67,32.5 67.5,32 POWER_PIN_2.1 | 70,55.5 68.12,57.38 68.12,59.01 | 68.12,59.01 68.12,61.59 68.27,61.73 IC2.59 | 55.33,54.4 57.5,56.57 57.5,57.5 | 57.5,58.5 57.5,63 57,63.5 | 57.5,58.5 57.5,57.5 | 57.5,57.5 67.25,57.5 | 67.25,57.5 68,57.5 | 86.5,31.5 86.5,28.23 | 86.5,28.23 86.5,25.5 C3.1 | 86.5,28.23 79.31,35.42 C10.1 79.5,37 80.5,38 80.5,63 | 80,90 80,86.5 | C9.1 77,74.5 | 79.5,86 77.13,83.63 77.13,75.5 | 80.5,63 80.5,64.5 77,68 | 69,62.5 69.5,63 80.5,63 | 79,37 v74,32 | 49,69.5 42.29,62.79 42.29,59.21 43,58.5 55.25,58.5 | 57.5,58.5 55.25,58.5 | 12.5,66 12.5,69 13,69.5 19.5,69.5 22,67 24.2,67 24.2,69.35 25.15,70.3 34.87,70.3 | IC2.13 56.5,52.75 56,52.25 54.5,52.25 54.5,53.62 IC2.9 | 67.75,53.5 67.25,54 67.25,57.5 | 54.75,61.5 55.25,61 55.25,58.5 | 67.5,63.75 67,63.25 66.44,63.25 65.47,62.28 65.47,61.66 68.12,59.01 | JTAG.6 JTAG.4 13.97,25.4 19.3,25.4 22,28.1 | C13.1 34.87,66.22 34.87,70.3
  Bottom 0.254: v74,32 68,32 POWER_PIN_2.1
5V
  Top 0.152: 31,83.5 C7.1 | 23,83.5 C6.+ 23,84 | 23,91 FU1.1
  Top 0.254: 23,83.5 31,83.5 | 23,84 23,91 | D3.2 20.32,71.25 20.32,82.55 21.34,83.57 C6.+
D0  (via drill 0.35)
  Top 0.152: 68.29,63.17 IC2.61
  Top 0.254: 68.29,63.17 69.12,64 v74.5,64 | v86,54 86.87,53.13 86.87,49.13 91.5,44.5 LED2.A
  Bottom 0.254: v74.5,64 84.5,54 v86,54
D1  (via drill 0.35)
  Top 0.152: IC2.62 67.92,63.51 | 91.5,49.5 LED3.A
  Top 0.254: 67.92,63.51 v66.35,61.94 | 91.5,49.5 v88,53
  Bottom 0.254: v66.35,61.94 66.35,61.6 74.95,53 v88,53
D2  (via drill 0.35)
  Top 0.152: 91.5,54.5 LED4.A
  Top 0.254: v75.5,64.5 75.18,64.82 67.82,64.82 67.5,64.5 IC2.64 | v86,64 86,63.24 86.97,62.27 86.97,59.03 91.5,54.5
  Bottom 0.152: 76,64 v75.5,64.5
  Bottom 0.254: v86,64 76,64
D3  (via drill 0.35)
  Top 0.152: 66.51,64.95 IC2.66 | 91.5,59.5 LED5.A
  Top 0.254: 66.51,64.95 64.6,63.04 v63.98,63.04 | 91.5,59.5 v86,65
  Bottom 0.254: v63.98,63.04 66.44,65.5 75.5,65.5 76,65 v86,65
D4  (via drill 0.35)
  Top 0.152: 66.3,65.37 IC2.67 | 91.5,65 LED6.A
  Top 0.254: 66.3,65.37 66.93,66 v76,66 | v86,66 91.5,66 91.5,65
  Bottom 0.254: v86,66 v76,66
D5  (via drill 0.35)
  Top 0.152: 66,65.75 IC2.68 | 91.5,69.75 LED7.A
  Top 0.254: 66,65.75 67.25,67 v75.5,67 | v85.75,67 91.5,67 91.5,69.75
  Bottom 0.254: v85.75,67 v75.5,67
D6  (via drill 0.35)
  Top 0.152: 65.5,66 IC2.69
  Top 0.254: v76,76.5 65.5,66 | v86,76.5 91.5,76.5 91.5,75 LED8.A
  Bottom 0.254: v86,76.5 v76,76.5
D7  (via drill 0.35)
  Top 0.152: 65,66.25 IC2.70 | 91.5,80 LED9.A
  Top 0.254: 65,66.25 63.76,65.01 v63.76,64.96 | v64.5,71.52 72.44,79.46 72.44,91.36 74.33,93.25 88.55,93.25 90.75,91.05 90.75,80.75 91.5,80
  Bottom 0.254: v64.5,71.52 63.76,70.78 v63.76,64.96
D+  (via drill 0.35)
  Top 0.152: 58,51.5 IC2.17 | 28.5,42 R12.2
  Top 0.254: v52.5,46 58,51.5 | v36.86,50.7 30.77,50.7 30.77,44.27 28.5,42
  Bottom 0.254: v52.5,46 47.8,50.7 v36.86,50.7
D-  (via drill 0.35)
  Top 0.152: v53.75,46.25 53.75,46.5 | 39.64,51.53 v39.78,51.53 | 58.25,51 IC2.18 | 28.25,48.5 R11.2
  Top 0.254: 53.75,46.5 58.25,51 | 39.64,51.53 38.58,52.59 28.25,52.59 28.25,48.5
  Bottom 0.254: v53.75,46.25 48.47,51.53 v39.78,51.53
GND  (via drill 0.35)
  Top 0.152: 114,52.5 T2.2 | 88,44.5 LED2.C | 52.07,69.72 C12.2 | 59.81,67.05 IC2.79 | D11.1 6.43,37.28 | v9.3,46.9 8.53,47.67 X1.5 | 70.4,55.79 IC2.46 | IC2.60 | 64.5,62.2 v64.5,62.1 | C13.2 36.2,65.53 35.08,64.4 30.85,64.4 v29.21,66.04 | v29.21,74.93 31.62,74.93 C5.2
  Top 0.254: 38,49.5 38.03,49.65 | 38.73,47.91 38.82,47.72 | C4.2 48.91,74.93 v49.53,74.93 | 52.07,69.72 52.07,66.04 v50.8,64.77 | v59.12,70.05 58.92,69.85 58.92,67.95 59.81,67.05 | IC2.10 57.64,56.05 v61.14,56.05 | v56.35,60.54 56.77,60.96 | v13,46.9 13,37.81 11.67,36.49 7.22,36.49 6.43,37.28 | v64.7,53.4 66.38,53.4 IC2.37 | v67.31,49.53 66.72,49.53 IC2.32 | 70.4,55.79 69.85,56.34 69.85,56.92 v69.12,57.65 | IC2.60 67.6,61.77 v67.43,61.77 | C5.2 31.08,75.47 C7.2 | IC2.65 64.5,62.2
  Bottom 0.152: v61.14,56.05 v61.13,56.05 | v56.35,60.54 56.65,60.54 | v13,46.9 12.9,47 | 9.4,47 v9.3,46.9 | v64.5,62.1 65.65,62.1 66.1,62.55 66.65,62.55 v67.43,61.77 | v29.21,66.04 v29.21,74.93
  Bottom 0.2: 64.75,53.45 v64.7,53.4
  Bottom 0.254: v49.53,74.93 49.53,66.04 v50.8,64.77 51.27,64.77 56.55,70.05 v59.12,70.05 | 56.65,60.54 v61.13,56.05 62.05,56.05 v64.7,53.4 67.31,50.79 v67.31,49.53 | 12.9,47 9.4,47 | 64.75,53.45 64.75,59.55 65.8,60.6 66.17,60.6 | v69.12,57.65 66.17,60.6 | 66.17,60.6 66.4,60.6 65.3,61.7 65.3,62.3 67.4,64.4 71.65,64.4 69.02,61.77 v67.43,61.77
  pour Top: 0,92.71 0,93.6 arc-90 4.2,97.8 148.58,97.8 arc-90 152.4,93.98 152.4,3.81 arc-90 148.59,0 3.81,0 arc-90 0,3.81
  pour Bottom: 0,87.63 0,93.98 arc-90 3.81,97.79 148.59,97.79 arc-90 152.4,93.98 152.4,5.08 152.4,3.81 arc-90 148.59,0 5.08,0 3.81,0 arc-90 0,3.81
N$1
  Top 0.152: 113,80.5 T1.3 | 122,71.5 K1.A2
  Top 0.254: 122,71.5 122,79.2 120.7,80.5 113,80.5
N$2
  Top 0.254: LED1.A 33.5,91 39.5,91 R1.1
N$3
  Bottom 0.813: K1.NO 144.19,71.47 X2.1
N$4
  Bottom 0.813: K1.NC 144.13,83.47 145.15,82.45 X2.3
N$5
  Top 0.152: 113.5,54 T2.3
  Top 0.254: 113.5,54 120,54 122,52 122,44 K2.A2
N$6
  Top 0.152: 112,78.5 T1.1 | 102,70 J1.1
  Top 0.254: 112,70 112,78.5 | 112,70 102,70 | R2.2 111.61,69.61 112,70
N$7
  Top 0.2: T3.3 113.2,26.67
  Top 0.254: K3.A2 121.82,15.24 118.11,15.24 116.9,16.45 116.9,26.3 116.53,26.67 113.2,26.67
N$8
  Top 0.152: 112,52 T2.1 112,52.5
  Top 0.254: 112,52 112,43.18 112,42.3 R9.2 | 112,52.5 112,54.37 110.87,55.5 102,55.5 J4.1
N$9
  Top 0.152: 112,24 T3.1 112,24.5
  Top 0.254: 112,24 112,13.97 112,13.28 R10.2 | 112,24.5 112,25.7 110.64,27.06 102.22,27.06 J5.1
N$10
  Bottom 0.152: 145,77.5 X2.2
  Bottom 0.813: K1.COM 144.97,77.47 145,77.5
N$11
  Bottom 0.813: K2.NO 144.33,43.53 X3.1
N$12
  Bottom 0.813: K2.COM 145.27,49.53 X3.2
N$13
  Bottom 0.813: K2.NC 144.27,55.53 X3.3
N$14
  Bottom 0.813: K3.COM 120.28,21.7 X4.2
N$15
  Bottom 0.813: K3.NO 144.19,15.59 X4.1
N$16
  Bottom 0.813: K3.NC 144.41,27.59 X4.3
N$18  (via drill 0.35)
  Top 0.152: 71,56 IC2.47 | 71,56.5 IC2.48 71.5,56 | 69,55 IC2.43 69.5,54.5 69.5,54.75 | 66.5,52 IC2.35 67,51.5 | 66.5,52.5 IC2.36 | 68,52.5 IC2.38 | 69,53.5 IC2.41 68.5,54 | 69,54.5 IC2.42 | 69.75,55 IC2.44
  Top 0.254: 71,56.5 71,56 | 69,55 69,54.5 68.5,54 68.5,53.5 IC2.40 | 66.5,52.5 66.5,52 | 68.5,52 68,52.5 | 68.5,52 69,52 69,52.5 | 69,53.5 69,52.5 | 68,51.5 68.5,51.5 68.5,52 | 68,51.5 67,51.5 | 71.5,56 71.5,55 69,52.5 | 68,51.5 v68,37.5 | 69.5,54.75 69.75,55
  Bottom 0.152: 62.5,32 POWER_PIN_2.3
  Bottom 0.254: v68,37.5 62.5,32
N$20
  Top 0.152: 59.47,50.03 59.46,50.05 IC2.21 | 59,50.5 IC2.20 | 66,51 IC2.33 65.5,51.5 | 66,51.5 IC2.34 | 63,49 IC2.26 63.5,48.5 | IC2.30 | IC2.29 64,50 | 63.5,49 IC2.27 | 64,49.5 IC2.28 | 59,51 IC2.19 | POWER_PIN_2.4
  Top 0.254: 59.47,50.03 59,50.5 59,51 64,51 | 66,51.5 66,51 | 63,49 63.5,49 64,49.5 64,50 64,51 | IC2.29 IC2.30 | 65.5,51.5 65,52 64,52 64,51 | POWER_PIN_2.4 63.5,35.54 63.5,48.5
N$21  (via drill 0.35)
  Top 0.152: 25,48.5 R11.1 | 10.5,39 10,38.5 D11.2 | 10,50.5 9,50.5 X1.2 | 10.5,50 10.5,50.3 | 11.5,51.3 v11.93,51.3 | 16.16,52.8 R13.1
  Top 0.254: 25,48.5 25,52.5 16.5,52.5 R13.1 | 10.5,39 10.5,50 10,50.5 | 10.5,50.3 11.5,51.3 | v19.99,51.33 17.63,51.33 16.16,52.8
  Bottom 0.2: 19.96,51.3 v19.99,51.33
  Bottom 0.254: v11.93,51.3 19.96,51.3
N$22
  Top 0.152: 25.34,41.5 25,41.5 R12.1 | X1.3 8.5,49.67
  Top 0.254: 25,41.5 19,41.5 19,38.5 D10.2 | 8.5,49.67 4.77,49.67 3.87,48.77 3.87,46.83 4.92,45.78 4.92,14.18 12.19,6.91 23.91,6.91 25.34,8.34 25.34,41.5
N$23
  Top 0.152: 54.5,55 IC2.7 | 39,33.5 SENSOR_ONE.1
  Top 0.254: 54.5,55 41,41.5 41,35.5 39,33.5
N$24
  Top 0.152: 72,56.75 72,57 IC2.50 | 71.5,56.75 IC2.49
  Top 0.254: POWER_PIN_2.2 65.5,31.5 65.5,30.32 68.69,30.32 69,30.63 69,51 72.31,54.31 72.31,56.75 72,56.75 71.5,56.75
  Bottom 0.152: 65,32 POWER_PIN_2.2
  Bottom 0.254: 65,32 65,33 79,47 J7.2
N$25  (via drill 0.35)
  Top 0.152: 54.25,55.5 IC2.6
  Top 0.254: 54.25,55.5 55.4,56.65 v55.59,56.65
  Bottom 0.152: 39.25,36 39,36 SENSOR_ONE.2
  Bottom 0.254: v55.59,56.65 55.59,44.72 47.97,44.72 39.25,36
N$26
  Top 0.254: IC2.5 53.5,55.5 40.5,42.5 40.5,40.5 39,39 SENSOR_ONE.3
N$27
  Top 0.152: 72,60 IC2.51 71.5,59.5 | 70.5,61 IC2.55 | 70,61.5 IC2.56 | 71.5,60 IC2.52 | 71,61 IC2.54 | 71,60.5 71,60.25 IC2.53 | 69.25,62 IC2.58
  Top 0.254: 72,60 71.5,60 71,60.5 71,61 70.5,61 70,61.5 70,62 IC2.57 69.5,61.75 69.25,62 | 71.5,59.5 79,52 79,50.5 J7.1
N$28
  Top 0.152: 63.5,68.25 IC2.75
  Top 0.254: 63.5,68.25 74.5,79.25 74.5,86 Y1.3
N$29  (via drill 0.35)
  Top 0.254: IC2.4 53.49,56.1 54.39,57 v54.39,57.75
  Bottom 0.254: v54.39,57.75 48.89,52.25 36.85,52.25 35.57,50.97 35.57,42.43 36.75,41.25 38.75,41.25 SENSOR_ONE.4
N$30
  Top 0.254: IC2.3 53.04,56.45 40.34,43.75 39,43.75 SENSOR_ONE.5
N$31
  Top 0.152: IC2.1 52.5,57.25 52.75,57 IC2.2
  Top 0.254: IC2.2 52.55,57 J6.1
N$32  (via drill 0.35)
  Top 0.152: 54,61.5 IC2.95 | 53,61 IC2.97 53.5,60.5 | 52.5,60 IC2.99 | 53,60.5 IC2.98 | 54,61 IC2.96
  Top 0.254: 54,61.5 54,61 53.5,60.5 | 53,61 53,60.5 52.5,60 52.5,59.5 IC2.100 52,60 44,60 J6.2 | v56.5,78 54,75.5 54,63 53.34,62.34 53.34,61.49 IC2.96
  Bottom 0.254: v56.5,78 59.5,81 POWER_PIN_1.2
N$33
  Top 0.254: FU1.2 15.04,91.35 12.5,88.81 12.5,82 J2.PWR
N$35
  Top 0.152: 58,65.5 IC2.84 | 59,66.5 IC2.81 59.5,66 | 58.5,65.5 IC2.83 | 60.5,68 60.25,67.75 | 60.07,67.45 IC2.78 61.08,66.48 | 63.5,67.5 IC2.74 | 65,81 POWER_PIN_1.4 | 60.5,68.5 IC2.76 | 58.5,66 58.75,66 IC2.82 | 60.5,67.75 IC2.77
  Top 0.2: IC2.78 61,66.56 61,66.48
  Top 0.254: 58,65.5 58,66 IC2.83 | 59,66.5 58.5,66 58.5,65.5 | 60.37,67.75 60.07,67.45 | 60.5,68 60.5,68.5 60.5,76.5 65,81 | 63.5,67.5 62.48,66.48 61.08,66.48 | 59.5,66 60,65.5 61,65.5 61,66.48 | 60.5,67.75 60.37,67.75 | 60.37,67.75 60.25,67.75
N$36  (via drill 0.35)
  Top 0.152: 55.46,62.96 55.5,63 IC2.91 | IC2.92 55.21,62.71 | 57.5,64.5 IC2.86 57,65 | 57.5,65 IC2.85 | 55.5,64.5 55.5,64.25 | 56.25,63.5 IC2.89 | 57,64.25 IC2.87
  Top 0.254: 55.21,62.71 55.46,62.96 55,63.42 55,64 55.5,64.5 56,65 56.5,65 | 57.5,65 57.5,64.5 | 57,65 56.5,65 | v56.5,75 56.5,65 | 55.5,64.25 56.25,63.5 | 57,64.25 57.25,64.5 IC2.86
  Bottom 0.254: v56.5,75 62.5,81 POWER_PIN_1.3
RELAY_SWITCH_01
  Top 0.254: IC2.71 64.76,66.69 76.5,78.43 76.5,90.03 78.72,92.25 83.55,92.25 85,90.8 85,41.5 98.5,28 J5.2
RELAY_SWITCH_02  (via drill 0.35)
  Top 0.254: v66.02,59.42 62.05,63.39 62.05,64.72 64.37,67.04 IC2.72
  Bottom 0.152: 98.5,55.75 98.75,55.75 J4.2
  Bottom 0.254: v66.02,59.42 73.44,52 94.75,52 98.5,55.75
RELAY_SWITCH_03  (via drill 0.35)
  Top 0.152: 64.13,67.44 IC2.73
  Top 0.254: v73.75,77 73.69,77 64.13,67.44
  Bottom 0.152: 98.75,70 J1.2
  Bottom 0.254: v73.75,77 80.75,70 98.75,70
S1_IN  (via drill 0.35)
  Top 0.254: v59,46.5 54.5,42 54.5,9.5 53.5,8.5 41.5,8.5 41.5,9.5 S1.3 41.5,10 41.5,16 S1.4 | v60.28,53.16 59.88,53.16 58.25,52.41 IC2.16
  Bottom 0.254: v60.28,53.16 60.28,47.78 v59,46.5
S2_IN  (via drill 0.35)
  Top 0.152: S2.4 52.86,16.48
  Top 0.254: v50.6,42.99 50.6,45.48 57.32,52.2 IC2.15 | v52.86,39.66 52.86,16.48 | S2.3 53,10 53,16 S2.4
  Bottom 0.254: v52.86,39.66 52.86,40.73 v50.6,42.99
S3_IN  (via drill 0.35)
  Top 0.152: IC2.14 | 64.5,16 S3.4
  Top 0.254: v58.28,53.86 IC2.14 | v58,44.5 56,42.5 56,24.5 64,16.5 S3.4 | 64.5,16 64.5,10 S3.3
  Bottom 0.254: v58.28,53.86 58.28,44.78 v58,44.5
S4_IN  (via drill 0.35)
  Top 0.152: 56.5,53.5 IC2.12 | 75.5,16.5 S4.4
  Top 0.254: 56.5,53.5 57.79,54.79 66.21,54.79 v66.5,54.5 | v70.75,50.3 73,48.05 73,19 75.5,16.5 | S4.3 76,10 76,16 S4.4
  Bottom 0.152: 66.55,54.5 v66.5,54.5
  Bottom 0.254: v70.75,50.3 66.55,54.5
S5_IN  (via drill 0.35)
  Top 0.152: 55,54.75 IC2.8
  Top 0.254: S5.4 87.5,16 87.5,10 S5.3 87,9.75 87,8.26 74.95,8.26 63.75,19.46 63.75,32.5 64,32.75 64,46.21 v65.63,47.84 | 55,54.75 56.7,56.45 v56.7,57.6
  Bottom 0.254: v65.63,47.84 65.63,49.07 57.1,57.6 v56.7,57.6
TCK  (via drill 0.35)
  Top 0.152: 60.5,49 IC2.24 | 18.5,29 R3.2 | 9,25.5 JTAG.1
  Top 0.254: 60.5,49 42.45,30.95 v39.3,30.95 | 9,25.5 9,27.1 10.9,29 18.5,29
  Bottom 0.152: 9,25.5 JTAG.1
  Bottom 0.254: v39.3,30.95 35.85,27.5 11,27.5 9,25.5
TDI  (via drill 0.35)
  Top 0.152: JTAG.9 9,15.5 9,15.6 9.9,16.5 12.5,16.5 17.5,21.5 18.5,21.5 R4.2 19,21.5 19,18.25 v19.15,18.1 | 60.25,49.5 IC2.23
  Top 0.254: 60.25,49.5 60.75,50 61.92,50 61.92,46.42 v56.75,41.25
  Bottom 0.254: v56.75,41.25 33.6,18.1 v19.15,18.1
TDO  (via drill 0.35)
  Top 0.152: 18.5,15 R5.2 | 60.75,48.5 IC2.25
  Top 0.254: 18.5,15 16.21,15 14.64,13.43 7.37,13.43 6.58,14.22 6.58,20.58 8.5,22.5 JTAG.3 | 60.75,48.5 59.75,47.5 59.75,45.25 v56.75,42.25 | R5.2 16.98,17.16 v16.98,18.73
  Bottom 0.254: v56.75,42.25 35.25,20.75 19,20.75 v16.98,18.73
TMS  (via drill 0.35)
  Top 0.152: v42.92,32.68 42.92,32.92 | 59.5,49.5 IC2.22 | 19,10.5 R6.2
  Top 0.254: 59.5,49.5 42.92,32.92 | 19,10.5 20.28,11.78 20.28,22.62 19.36,23.54 17.32,23.54 12.78,19 9,19 9,20 JTAG.5
  Bottom 0.152: 42.92,32.38 v42.92,32.68 | 9,20.5 JTAG.5
  Bottom 0.254: 42.92,32.38 32.15,21.61 10.11,21.61 9,20.5
V_USB  (via drill 0.35)
  Top 0.152: v15.76,59.48 15.76,59.5 | 9,51 X1.1
  Top 0.2: D2.2 22.8,59.5
  Top 0.254: 15.76,59.5 19.05,59.5 22.8,59.5 | v12.83,56.55 11.54,55.26 11.54,53.54 9,51
  Bottom 0.254: v15.76,59.48 v12.83,56.55
VOUT
  Top 0.152: 14.5,68 U1.3 | 44,77 C4.1 44,76.5
  Top 0.2: D3.1 25.29,68.56 25.29,62 | D2.1 25.29,59.71
  Top 0.254: K1.A1 122.5,83 123.5,82 123.5,81.28 123.5,57 122.5,56 K2.A1 123.5,55.41 123.5,29 122.5,28 K3.A1 121.99,28.02 103.43,28.02 103.43,29.57 102.59,30.41 101.01,30.41 100.27,29.67 100.27,18.22 89.43,7.38 39.72,7.38 38.5,8.6 38.5,27.96 36.5,29.96 36.5,44 38.5,46 SENSOR_ONE.6 39,46.5 40.5,48 40.5,60 | 14.5,68 20.5,62 25.29,62 25.29,59.71 | 44,77 44,82 C2.1 | 44,76.5 40.5,73 40.5,60 | 40.5,60 33.02,60 32.71,59.69 D2.1

### Text on the board
tPlace: Developed and released by Daineko.A
tNames: 95-100 | 85-92 | 74-84 | 3.3V | GND | 70 | 69 | RELAY_03 | 68 | 73 | Vin | 3.3V | 3.3V | 67 | GND | 95-100 | 66 | RELAY_02 | 72 | 1-2 | 64 | 51-58 | 62 | GND | vout | 49-50 | 61 | 3 | 4 | 5 | 6 | 19-34 | 7 | 35-48 | 49-50 | RELAY_01 | 3.3V | GND | 71 | TCK | GND | TDO | 3.3V | TMS | 3.3V | TDI | GND